# Altium project Yazaki_Led Status.PrjPcb
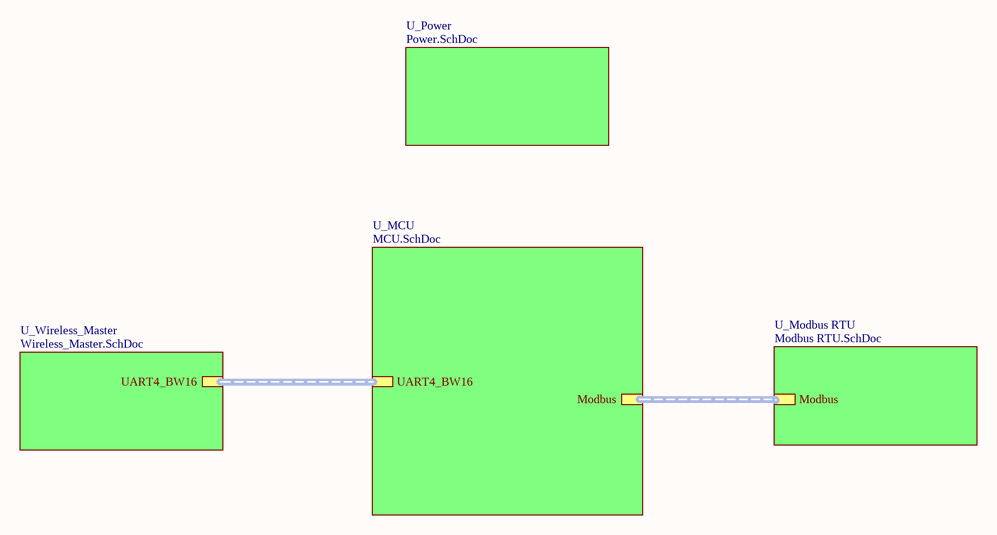
[diagram p0: Yazaki Led.SchDoc]
5 sheets, 81 parts. Net scope: hierarchical (ports join the sheet entries above them; power ports are global).
Board file: PCB.PcbDoc
Sheets:
  Yazaki Led.SchDoc
    U_MCU = MCU.SchDoc
    U_Wireless_Master = Wireless_Master.SchDoc
    U_Power = Power.SchDoc
    U_Modbus RTU = Modbus RTU.SchDoc

## Sheet Yazaki Led.SchDoc
size A4; SheetNumber: 1; SheetTotal: 5

### Sub-sheets
U_MCU = MCU.SchDoc: Modbus (harness Modbus), UART4_BW16 (harness UART4_ESP32)
U_Modbus RTU = Modbus RTU.SchDoc: Modbus (harness Modbus)
U_Power = Power.SchDoc: no entries
U_Wireless_Master = Wireless_Master.SchDoc: UART4_BW16 (harness UART4_ESP32)

### Buses and harness runs
harness sheet U_MCU/Modbus = sheet U_Modbus RTU/Modbus
harness sheet U_MCU/UART4_BW16 = sheet U_Wireless_Master/UART4_BW16

### Notes on the sheet
- Title
- Size:
- Date:
- A3
- Number:
- Time:
- Revision:
- Sheet
- of
- NICHIETSUVN.COM <http://NICHIETSUVN.COM>
- R&D
- File:

## Sheet MCU.SchDoc
size A; SheetNumber: 4; SheetTotal: 5
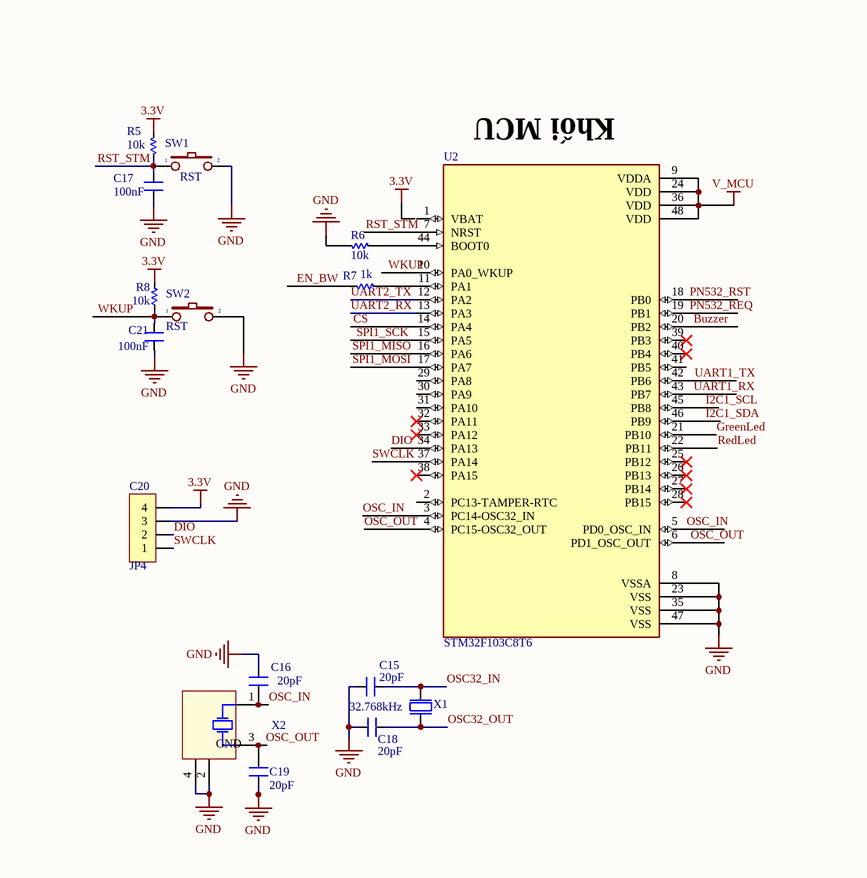
[diagram p1: MCU.SchDoc, left]
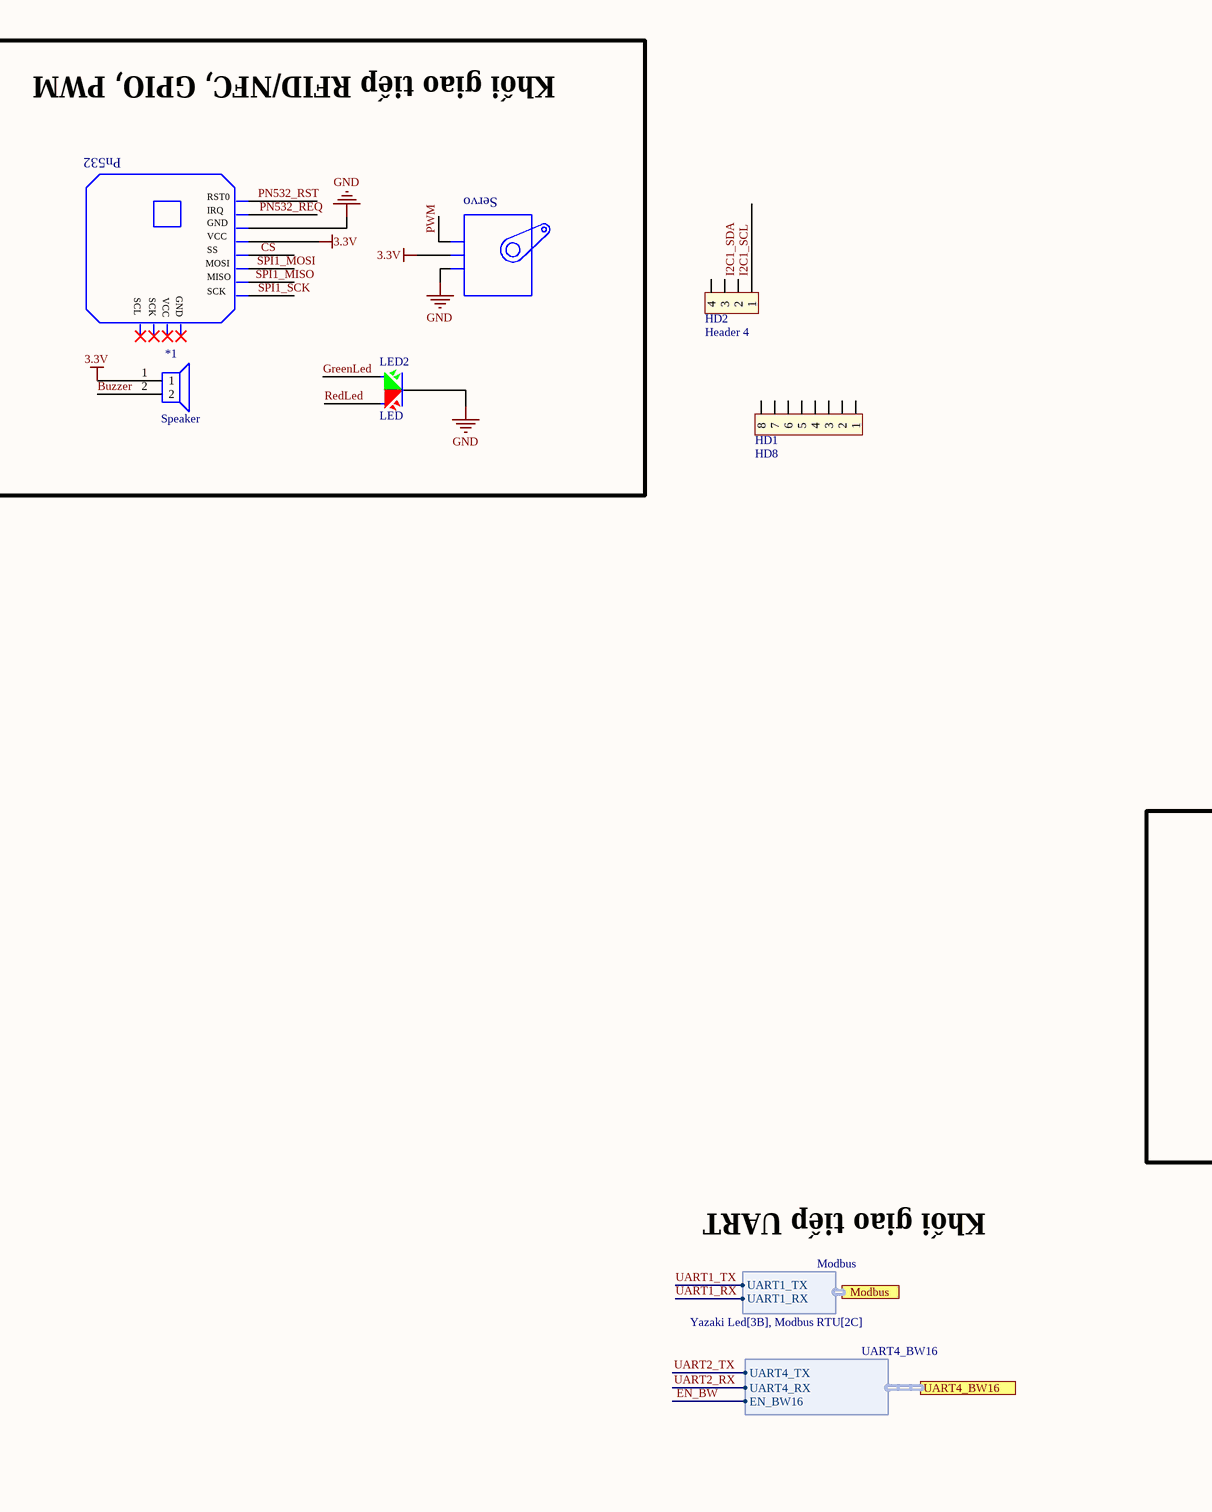
[diagram p2: MCU.SchDoc, right]

### Parts
*1  Speaker  [SPEAKER]
C15  20pF  [CN-SMD-0603]
C16  20pF  [CN-SMD-0603]
C17  100nF  [CN-SMD-0603]
C18  20pF  [CN-SMD-0603]
C19  20pF  [CN-SMD-0603]
C20  JP4  [JP4-C1T]
C21  100nF  [CN-SMD-0603]
HD1  HD8  [Header_8]
HD2  Header 4  [Header_4]
LED2  LED  [LED-52]
R5  10k  [RES-SMD-0603]
R6  10k  [RES-SMD-0603]
R7  1k  [RES-SMD-0603]
R8  10k  [RES-SMD-0603]
SW1  RST  [SW1-SMD]
SW2  RST  [SW1-SMD]
U2  STM32F103C8T6  [QFP50P900X900X160-48N]
X1  32.768kHz  [XTAL_3215]
X2  XT4  [XT4-16.000MHz-4_V]  (value not drawn)

### Ports
Modbus (harness Modbus, see Yazaki Led[3B], Modbus RTU[2C]), UART4_BW16 (harness UART4_BW16, see Yazaki Led[2B], Wireless_Master[2C])

### Harnesses
Modbus: UART1_TX, UART1_RX
UART4_BW16: UART4_TX, UART4_RX, EN_BW16

### Nets
3.3V: *1.1 C20.4 R5.1 R8.1 U2.9(VDDA) U2.24(VDD) U2.36(VDD) U2.48(VDD)  [also labelled V_MCU]
GND: C15.1 C16.2 C17.2 C18.1 C19.1 C20.3 LED2.2 R6.2 SW1.2 SW2.2 U2.8(VSSA) U2.23(VSS) U2.35(VSS) U2.47(VSS) X2.2(GND) X2.4(GND)
Buzzer: *1.2 U2.20(PB2)
CS: U2.14(PA4)
DIO: C20.2 U2.34(PA13)
EN_BW: R7.1 ; port UART4_BW16.EN_BW16
GreenLed: LED2.3 U2.21(PB10)
I2C1_SCL: HD2.1 U2.45(PB8)
I2C1_SDA: U2.46(PB9)
OSC32_IN: C15.2 X1.2(out)
OSC32_OUT: C18.2 X1.1(inp)
OSC_IN: C16.1 U2.3(PC14-OSC32_IN) U2.5(PD0_OSC_IN) X2.1(XTAL)
OSC_OUT: C19.2 U2.4(PC15-OSC32_OUT) U2.6(PD1_OSC_OUT) X2.3(XTAL)
PN532_REQ: U2.19(PB1)
PN532_RST: U2.18(PB0)
RedLed: LED2.1 U2.22(PB11)
RST_STM: C17.1 R5.2 SW1.1 U2.7(NRST)
SPI1_MISO: U2.16(PA6)
SPI1_MOSI: U2.17(PA7)
SPI1_SCK: U2.15(PA5)
SWCLK: C20.1 U2.37(PA14)
UART1_RX: U2.43(PB7) ; port Modbus.UART1_RX
UART1_TX: U2.42(PB6) ; port Modbus.UART1_TX
UART2_RX: U2.13(PA3) ; port UART4_BW16.UART4_RX
UART2_TX: U2.12(PA2) ; port UART4_BW16.UART4_TX
WKUP: R8.2 SW2.1 U2.10(PA0_WKUP)
NetR6_1: R6.1 U2.44(BOOT0)
NetR7_2: R7.2 U2.11(PA1)

Not connected (* = marked no-connect by the designer): C21 1 2; HD1 1 2 3 4 5 6 7 8; HD2 2 3 4; U2 1(VBAT) 2(PC13-TAMPER-RTC) 25(PB12)* 26(PB13)* 27(PB14)* 28(PB15)* 29(PA8) 30(PA9) 31(PA10) 32(PA11)* 33(PA12)* 38(PA15)* 39(PB3)* 40(PB4)* 41(PB5)

### Notes on the sheet
- Khối giao tiếp RFID/NFC, GPIO, PWM
- Pn532
- RST0
- IRQ
- GND
- Servo
- SCL
- SCK
- VCC
- MOSI
- SS
- MISO
- (near U2) Khối MCU
- Khối giao tiếp UART
- Labels drawn without touching a wire or pin: I2C1_SDA

### Library data of the parts
C15-C19 = CN: Value: 33pF
C20 = JP4: WR-PHD 2.54 mm Angled Socket Header; Manufacturer: W¨¹rth Elektronik eiSos GmbH; partNo: 613004143121; ComponentLink1 Description: Manufacturer; ComponentLink2 Description: Datasheet; NoPins: 04; Created Date: 29 March 2013; ComponentLink1URL: http://www.we-online.com; ComponentLink2URL: http://katalog.we-online.de/em/datasheet/6130xx143121.pdf; Created by: Karrer Zheng
C21 = CN_2: Value: 33pF
HD1 = Header8: Header 8; Creat by: VanDungEvn@Gmail.com
HD2 = Header4: Value: Header 4
LED2 = LED2: LED 2 colour Green and Red; Value: LED 3 - 5 ly 2 Colour
R5-R7 = Res-SMD: Resistor; Manufacturer: Generic Components; Class: Passive; Published: 08/06/2000; Publisher: Altium Hobart Technology Centre
R8 = Res-SMD_1: Resistor; Manufacturer: Generic Components; Class: Passive; Published: 08/06/2000; Publisher: Altium Hobart Technology Centre
SW1 SW2 = SW2: Switch button 2 pin; Value: SW chip 2 pin
U2 = STM32F103C8T6: ARMÂ® CortexÂ®-M3 STM32F1 Microcontroller IC 32-Bit 72MHz 64KB (64K x 8) FLASH 48-LQFP (7x7); MF: STMicroelectronics; Package: LQFP-48 STMicroelectronics; Price: None; Check_prices: https://www.snapeda.com/parts/STM32F103C8T6/STMicroelectronics/view-part/?ref=eda; Value: *; SnapEDA_Link: https://www.snapeda.com/parts/STM32F103C8T6/STMicroelectronics/view-part/?ref=snap; MP: STM32F103C8T6; Availability: In Stock; Purchase-URL: https://pricing.snapeda.com/search/part/STM32F103C8T6/?ref=eda
X1 = XTAL_SMD3215: XTAL SMD 3215, 32.768kHz, Cl=9pF, Total Tol: ±50ppm; Part Number: XTAL_SMD3215_32.768kHz_9pF_General; Manufacturer: *; Manufacturer Part Number: *; LatestRevisionDate: 2016-08-19; Pin Count: 2; Publisher: Nordic Semiconductor; Published: 2016-08-19; Value: 32.768kHz; Footprint Doc: XTAL_3215
X2 = XT4: Crystal, 16 MHz, -30 to 85 degC, 3.2 x 2.5 x 0.9 mm SMD; Value: 4Mhz

## Sheet Wireless_Master.SchDoc
size A; SheetNumber: 5; SheetTotal: 5
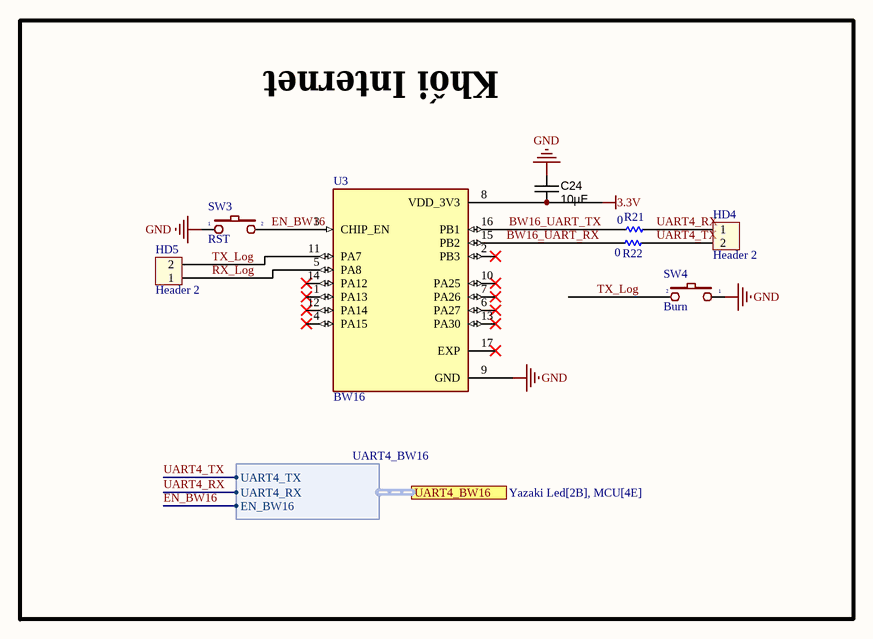
[diagram p3: Wireless_Master.SchDoc]

### Parts
C24  10µF  [CAPC1608X90N]
HD4  Header 2  [Header_2]
HD5  Header 2  [Header_2]
R21  0  [RES-SMD-0603]
R22  0  [RES-SMD-0603]
SW3  RST  [SW1-SMD]
SW4  Burn  [SW1-SMD]
U3  BW16  [MODULE_BW16]

### Ports
UART4_BW16 (harness UART4_BW16, see Yazaki Led[2B], MCU[4E])

### Harnesses
UART4_BW16: UART4_TX, UART4_RX, EN_BW16

### Nets
3.3V: C24.1 U3.8(VDD_3V3)
GND: C24.2 SW3.1 SW4.1 U3.9(GND)
BW16_UART_RX: R22.2 U3.15(PB2)
BW16_UART_TX: R21.2 U3.16(PB1)
EN_BW16: SW3.2 U3.3(CHIP_EN) ; port UART4_BW16.EN_BW16  [project net EN_BW]
RX_Log: HD5.1 U3.5(PA8)
TX_Log: HD5.2 SW4.2 U3.11(PA7)
UART4_RX: HD4.1 R21.1 ; port UART4_BW16.UART4_RX  [project net UART2_RX]
UART4_TX: HD4.2 R22.1 ; port UART4_BW16.UART4_TX  [project net UART2_TX]

Not connected (* = marked no-connect by the designer): U3 1(PA13)* 2(PB3)* 4(PA15)* 6(PA27)* 7(PA26)* 10(PA25)* 12(PA14)* 13(PA30)* 14(PA12)* 17(EXP)*

### Notes on the sheet
- Khối Internet

### Library data of the parts
C24 = CAPC_1uF_0603_X7R_35V_10%: 1µF ±10% 16V Ceramic Capacitor X7R 0603 (1608 Metric); Manufacturer 1: Taiyo Yuden; Manufacturer Part Number 1: GMK107AB7105KAHT; Voltage - Rated: 35V; Pcs 2: 10; Tolerance: ±10%; Operating Temperature: -55°C ~ 125°C; Package / Case: 0603 (1608 Metric); Temperature Coefficient: X7R; Ratings: AEC-Q200; Applications: Automotive; Packaging: Digi-Reel®; Supplier 1: Digi-Key; Supplier Part Number 1: 587-3352-6-ND; Supplier 2: http://www.tme.vn; Supplier Part Number 2: http://www.tme.vn/Product.aspx?id=728#page=pro_info; Price 2: 1800; Value: 10µF
HD4 HD5 = Header2: Value: Header 2
R21 R22 = Res-SMD: as R5 on sheet MCU; Published: 08/06/2000; Publisher: Altium Hobart Technology Centre
SW3 SW4 = SW2: as SW1 on sheet MCU
U3 = BW16: dual-frequency Wi-Fi Bluetooth SoC module; MF: AI-Thinker; Availability: Not in stock; Check_prices: https://www.snapeda.com/parts/BW16/AI-Thinker/view-part/?ref=eda; Value: *; Package: Package; MP: BW16; Price: None; SnapEDA_Link: https://www.snapeda.com/parts/BW16/AI-Thinker/view-part/?ref=snap

## Sheet Power.SchDoc
size A; SheetNumber: 3; SheetTotal: 5
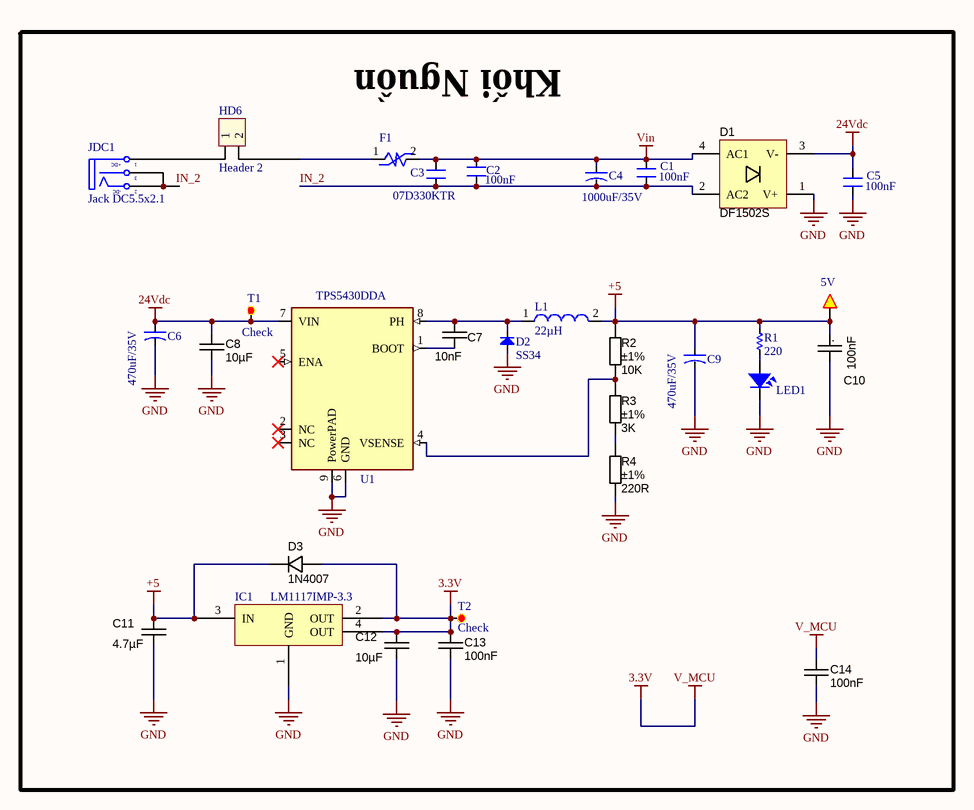
[diagram p4: Power.SchDoc]

### Parts
C1  100nF  [CN-SMD-1206]
C2  100nF  [CN2.5]
C3  07D330KTR  [CN2-T]
C4  1000uF/35V  [CA-ALU-5L]
C5  100nF  [CN-SMD-1206]
C6  470uF/35V  [CA-ALU-6.3]
C7  10nF  [CAPC1608X90N]
C8  10µF  [CAPC2012X135N]
C9  470uF/35V  [CA-ALU-6.3]
C10  100nF  [CAPC2012X135N]
C11  4.7µF  [CAPC2012X135N]
C12  10µF  [CAPC2012X135N]
C13  100nF  [CAPC1608X90N]
C14  100nF  [CAPC1608X90N]
Check1  5V  [SMD-2]
D1  DF1502S  [DIODE_DF_S]
D2  SS34  [DIO-SMD-106]
D3  1N4007  [DO-214AC]
F1  RUEF185  [RUEF165]  (value not drawn)
HD6  Header 2  [Header_2]
IC1  LM1117IMP-3.3  [SOT223]
JDC1  Jack DC5.5x2.1  [DC-IN]
L1  22µH  [IND_COIL_8D43]
LED1  LED  [LED-0805-Blue]  (value not drawn)
R1  220  [RES-SMD-0603]
R2  value 10K  Tolerance: ±1%  [RESC1608X55N]  (hidden comment: 10K_0603_1%)
R3  value 3K  Tolerance: ±1%  [RESC1608X55N]  (hidden comment: 3K_0603_0.5%)
R4  value 220R  Tolerance: ±1%  [RESC1608X55N]  (hidden comment: 220R_0603_1%)
T1  Check  [SMD_1.5]
T2  Check  [SMD_1.5]
U1  TPS5430DDA  [TPS5430]

### Nets
3.3V: C12.2 C13.1 C14.1 D3.A IC1.2(OUT) IC1.4(OUT) T2.1  [also labelled V_MCU]
24Vdc: C5.2 C6.1 C8.2 D1.3(V-) T1.1 U1.7(VIN)
+5: C9.1 C10.1 C11.2 Check1.1 D3.C IC1.3(IN) L1.2 R1.1 R2.2
GND: C5.1 C6.2 C8.1 C9.2 C10.2 C11.1 C12.1 C13.2 C14.2 D1.1(V+) D2.1(A) IC1.1(GND) LED1.2 R4.1 U1.6(GND) U1.9(PowerPAD)
Vin: C1.2 C2.2 C3.2 C4.1 D1.4(AC1) F1.2
IN_2: C1.1 C2.1 C3.1 C4.2 D1.2(AC2) JDC1.2(TN) JDC1.3(S)
NetC7_1: C7.1 U1.1(BOOT)
NetC7_2: C7.2 D2.2(K) L1.1 U1.8(PH)
NetF1_1: F1.1 HD6.2
NetHD6_1: HD6.1 JDC1.1(T)
NetLED1_1: LED1.1 R1.2
NetR2_1: R2.1 R3.2 U1.4(VSENSE)
NetR3_1: R3.1 R4.2

Not connected (* = marked no-connect by the designer): U1 2(NC)* 3(NC)* 5(ENA)*

### Notes on the sheet
- Khối Nguồn
- (in symbol CAPC_100nF_0805_X7R_50V_10%) .
- (in symbol Jac_DC) +DC; -DC

### Library data of the parts
C1-C3 C5 = CN: Value: 33pF
C4 C6 C9 = CN-ALU-DIP: Capacitor (Semiconductor SIM Model); Value: 104; LatestRevisionDate: 17-Jul-2002; LatestRevisionNote: Re-released for DXP Platform.; PackageReference: C1206; Publisher: Altium Limited
C7 = CAPC_10000pF_0603_50V_10%: 10000pF ±10% 50V Ceramic Capacitor X7R 0603 (1608 Metric); Manufacturer 1: TDK Corporation; Manufacturer Part Number 1: CGA3E2X7R1H103K080AA; Pcs 2: 10; Tolerance: ±10%; Operating Temperature: -55°C ~ 125°C; Package / Case: 0603 (1608 Metric); Voltage - Rated: 50V; Ratings: AEC-Q200; Temperature Coefficient: X7R; Supplier Part Number 1: 445-5662-6-ND; Supplier 1: Digi-Key; Supplier 2: https://www.thegioiic.com; Supplier Part Number 2: https://www.thegioiic.com/products/tu-gom-0603-10nf-50v; Price 2: 1900; Value: 10nF
C8 = CAPC_10uF_0805_X7R_25V_10%: 10µF ±10% 25V Ceramic Capacitor X7R 1206 (3216 Metric); Manufacturer 1: Taiyo Yuden; Manufacturer Part Number: TMK316AB7106KLHT; Pcs 2: 10; Supplier 1: Digi-Key; Supplier Part Number 1: 587-3485-6-ND; Tolerance: ±10%; Operating Temperature: -55°C ~ 125°C; Package / Case: 0805 (2012 metric); Voltage - Rated: 25V; Ratings: AEC-Q200; Temperature Coefficient: X7R; Supplier 2: https://www.thegioiic.com; Supplier Part Number 2: https://www.thegioiic.com/products/tu-gom-0805-10uf-25v; Price 2: 5800; Value: 10µF
C10 = CAPC_100nF_0805_X7R_50V_10%: 0.1µF ±10% 50V Ceramic Capacitor X7R 0805 (2012 Metric); Manufacturer 1: Samsung Electro-Mechanics; Manufacturer Part Number: CL21B104KBFXPJE; Pcs 2: 10; Supplier 1: Digi-Key; Supplier Part Number 1: 1276-CL21B104KBFXPJEDKR-ND; Tolerance: ±10%; Operating Temperature: -55°C ~ 125°C; Package / Case: 0805 (2012 metric); Voltage - Rated: 50V; Ratings: AEC-Q200; Temperature Coefficient: X7R; Price 2: 2000; Supplier 2: https://www.thegioiic.com; Supplier Part Number 2: https://www.thegioiic.com/products/tu-gom-0805-100nf-0-1uf-50v; Value: 100nF
C11 C12 = CAPC_4.7uF_0805_X7R_50V_10%: 4.7µF ±10% 50V Ceramic Capacitor X7R 0805 (2012 Metric); Manufacturer 1: TDK Corporation; Manufacturer Part Number: CGA4J1X7R1H475K125AE; Pcs 2: 1; Package / Case: 0805 (2012 metric); Tolerance: ±10%; Voltage - Rated: 50V; Temperature Coefficient: X7R; Ratings: AEC-Q200; Operating Temperature: -55°C ~ 125°C; Supplier 1: Digi-Key; Supplier Part Number 1: 445-181410-6-ND; Supplier 2: https://www.thegioiic.com; Supplier Part Number 2: https://www.thegioiic.com/products/tu-gom-0805-4-7uf-50v; Price 2: 680
  C11: Value: 4.7µF
  C12: Value: 10µF
C13 C14 = CAPC_100nF_0603_X7R_50V_10%: 0.1µF ±10% 50V Ceramic Capacitor X7R 0603 (1608 Metric); Manufacturer 1: TDK Corporation; Manufacturer Part Number 1: CGA3E2X7R1H104K080AA; Pcs 2: 10; Supplier 1: Digi-Key; Supplier Part Number 1: 445-5666-6-ND; Tolerance: ±10%; Operating Temperature: -55°C ~ 125°C; Package / Case: 0603 (1608 Metric); Voltage - Rated: 50V; Ratings: AEC-Q200; Temperature Coefficient: X7R; Applications: Automotive; Packaging: Digi-Reel®; Supplier 2: www.thegioiic.com; Supplier Part Number 2: https://www.thegioiic.com/products/tu-gom-0603-100nf-0-1uf-50v; Price 2: 1800; Value: 100nF
Check1 T1 T2 = Test: WR-PHD 2.54 mm Angled Socket Header; Manufacturer: W¨¹rth Elektronik eiSos GmbH; partNo: 613002143121; ComponentLink1 Description: Manufacturer; ComponentLink2 Description: Datasheet; NoPins: 02; Created Date: 29 March 2013; ComponentLink1URL: http://www.we-online.com; ComponentLink2URL: http://katalog.we-online.de/em/datasheet/6130xx143121.pdf; Created by: Karrer Zheng
D1 = DIODE_DF1502S: Bridge Rectifier Single Phase Standard 200V Surface Mount DF-S; Manufacturer 1: Diodes Incorporated; Manufacturer Part Number 1: DF1502S-T; Ratings: 200V; 1.5A; Pcs 2: 1; Package / Case: 4-SMD, Gull Wing; Diode Type: Standard; Mounting Type: Surface Mount; Supplier 1: Digi-Key; Supplier Part Number 1: DF1502SDIDKR-ND; Supplier 2: https://www.thegioiic.com; Supplier Part Number 2: https://www.thegioiic.com/products/df1502s-cau-chinh-luu-200v-1-5a; Price 2: 3500
D2 = Diode SMD: Default Diode; Code - JEDEC: DO-214-AB; Value: 1N5007; Published: 8-Jun-2000; Revision: July-2002: Re-released for DXP Platform.; Publisher: Altium Limited
D3 = DIODE_1N4007: Diode  Standard Rectifier SMD 1000V 1A SMA; Manufacturer 1: Micro Commercial Co; Manufacturer Part Number 1: SM4007PL-TP; Speed: Standard Recovery >500ns, > 200mA (Io); Ratings: 1000V; 1A; Pcs 2: 1; Package / Case: DO-214AC, SMA; Diode Type: Standard; Mounting Type: Surface Mount; Supplier 1: Digi-Key; Supplier Part Number 1: SM4007PL-TPMSDKR-ND; Supplier 2: https://www.thegioiic.com; Supplier Part Number 2: https://www.thegioiic.com/products/1n4007-m7-diode-chinh-luu-1a-1kv; Price 2: 1000
HD6 = Header2: Value: Header 2
IC1 = IC_LM1117IMP-3.3: Linear Voltage Regulator IC  1 Output  800mA SOT-223; Manufacturer: Texas Instruments; Manufacturer Part Number: LM1117IMP-3.3/NOPB; Voltage - Input (Max): 15V; Voltage Dropout (Max): 1.2V @ 800mA; Protection Features: Over Current, Over Temperature; PSRR: 75dB (120Hz); Pcs 2: 1; Supplier 1: Digi-Key; Supplier Part Number 1: LM1117IMP-3.3/NOPBDKR-ND; Current - Output: 800mA; Operating Temperature: -40°C ~ 125°C; Price 2: 11000; Supplier Device Package: SOT-223; Supplier 2: https://www.thegioiic.com; Supplier Part Number 2: https://www.thegioiic.com/products/lm1117imp-3-3-nopb-ic-on-ap-3-3v-800ma
JDC1 = Jac_DC: Cắm; Ten_Linh_Kien: Jack DC5.5x2.1MM DC5501; Ma_Hang: MH000923; Don_Vi: Con; Kieu_Chan: *; Ghi_Chu: *; Chung_Loai: Cắm
L1 = INDC_SMD_22uH_8D43: 22µH Shielded Wirewound Inductor 950mA 380mOhm Max Nonstandard; Manufacturer 1: Yageo; Current Rating (Amps): 3.25 A; Ratings: None AEC-Q200; Pcs 2: 1; Supplier 1: Digi-Key; Operating Temperature: -40°C ~ 125°C; Value: 22µH; Supplier 2: https://www.thegioiic.com/; Supplier Part Number 2: https://www.thegioiic.com/products/cuon-cam-dan-smd-8d43-220-22uh-3-25a; Price 2: 2000
LED1 = LED SMD: Value: LED 3 - 5 ly 2 Colour
R1 = Res-SMD: as R5 on sheet MCU; Published: 08/06/2000; Publisher: Altium Hobart Technology Centre
R2 = RES_10K_0603_1%: 10 kOhms ±1% 0.1W, 1/10W Chip Resistor 0603 (1608 Metric) Anti-Sulfur, Automotive AEC-Q200, Moisture Resistant Thin Film; Manufacturer: Stackpole Electronics Inc; Manufacturer Part Number: RMCF0603FT10K0; Temperature Coefficient: ±100ppm/°C; Pcs 2: 50; Package / Case: 0603 (1608 Metric); Power (Watts): 1/10W; Supplier 1: Digi-Key; Supplier Part Number 1: RMCF0603FT10K0DKR-ND; Ratings: Automotive AEC-Q200; Operating Temperature: -55°C ~ 155°C; Supplier 2: www.thegioiic.com; Supplier Part Number 2: https://www.thegioiic.com/products/dien-tro-10-kohm-0603-1; Price 2: 2000
R3 = RES_3K_0603_1%: 3 kOhms ±1% 0.1W, 1/10W Chip Resistor 0603 (1608 Metric) Automotive AEC-Q200 Thick Film; Manufacturer: Stackpole Electronics Inc; Manufacturer Part Number: RMCF0603FT3K00; Temperature Coefficient: ±100ppm/°C; Pcs 2: 50; Package / Case: 0603 (1608 Metric); Power (Watts): 1/10W; Supplier 1: Digi-Key; Supplier Part Number 1: RMCF0603FT3K00DKR-ND; Ratings: AEC-Q200; Supplier Part Number 2: https://www.thegioiic.com/products/dien-tro-3-kohm-0603-1; Supplier 2: www.thegioiic.com; Operating Temperature: -55°C ~ 155°C; Price 2: 2000
R4 = RES_220R_0603_1%: 220 Ohms ±1% 0.1W, 1/10W Chip Resistor 0603 (1608 Metric) Automotive AEC-Q200 Thick Film; Manufacturer: Stackpole Electronics Inc; Manufacturer Part Number: RMCF0603FT220R; Temperature Coefficient: ±100ppm/°C; Pcs 2: 50; Package / Case: 0603 (1608 Metric); Ratings: AEC-Q200; Supplier 1: Digi-Key; Supplier Part Number 1: RMCF0603FT220RDKR-ND; Power (Watts): 0.1W, 1/10W; Operating Temperature: -55°C ~ 155°C; Composition: Thick Film; Supplier 2: www.thegioiic.com; Supplier Part Number 2: https://www.thegioiic.com/products/dien-tro-220-ohm-0603-1; Price 2: 2000

## Sheet Modbus RTU.SchDoc
size A; SheetNumber: 2; SheetTotal: 5
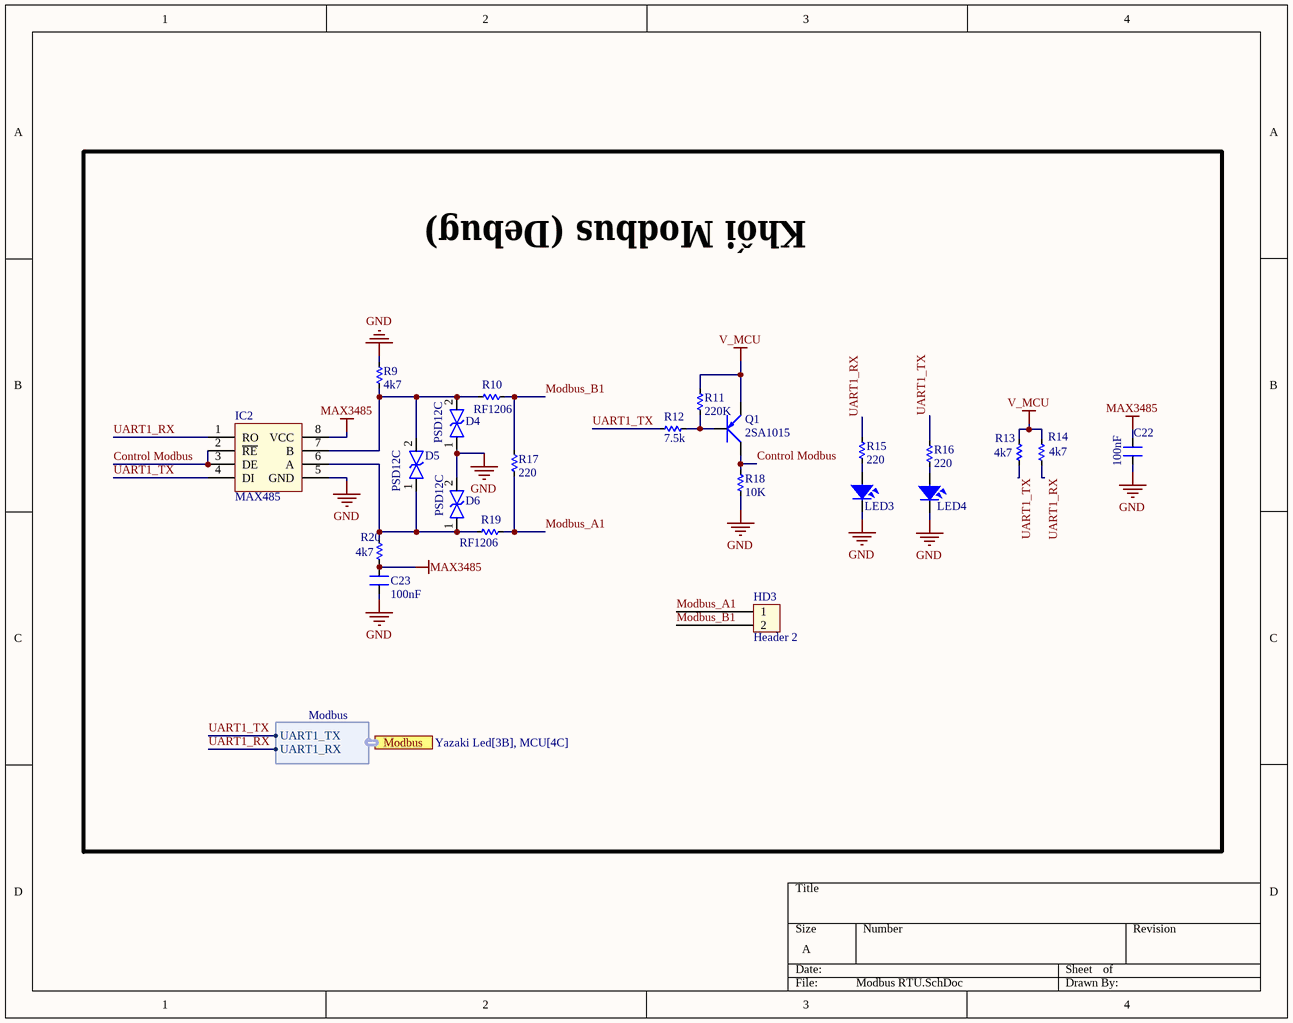
[diagram p5: Modbus RTU.SchDoc]

### Parts
C22  100nF  [CN-SMD-0603]
C23  100nF  [CN-SMD-0603]
D4  PSD12C  [PSD12C]
D5  PSD12C  [PSD12C]
D6  PSD12C  [PSD12C]
HD3  Header 2  [Header_2]
IC2  MAX485  [SO8]
LED3  LED  [LED-0805-Blue]  (value not drawn)
LED4  LED  [LED-0805-Blue]  (value not drawn)
Q1  2SA1015  [SOT23-321]
R9  4k7  [RES-SMD-0603]
R10  RF1206  [RES-SMD-1206]
R11  220K  [RES-SMD-0603]
R12  7.5k  [RES-SMD-0603]
R13  4k7  [RES-SMD-0603]
R14  4k7  [RES-SMD-0603]
R15  220  [RES-SMD-0603]
R16  220  [RES-SMD-0603]
R17  220  [RES-SMD-0603]
R18  10K  [RES-SMD-0603]
R19  RF1206  [RES-SMD-1206]
R20  4k7  [RES-SMD-0603]

### Ports
Modbus (harness Modbus, see Yazaki Led[3B], MCU[4C])

### Harnesses
Modbus: UART1_TX, UART1_RX

### Nets
GND: C22.1 C23.2 D4.1 D6.2 IC2.5(GND) LED3.2 LED4.2 R9.1 R18.1
MAX3485: C22.2 C23.1 IC2.8(VCC) R20.1
V_MCU: Q1.1(E) R11.2 R13.1 R14.1  [project net 3.3V]
Control Modbus: IC2.2(~{RE}) IC2.3(DE) Q1.2(C) R18.2
Modbus_A1: HD3.1 R17.2 R19.1
Modbus_B1: HD3.2 R10.1 R17.1
UART1_RX: IC2.1(RO) R14.2 R15.1 ; port Modbus.UART1_RX
UART1_TX: IC2.4(DI) R12.1 R13.2 R16.1 ; port Modbus.UART1_TX
NetD4_2: D4.2 D5.2 IC2.7(B) R9.2 R10.2
NetD5_1: D5.1 D6.1 IC2.6(A) R19.2 R20.2
NetLED3_1: LED3.1 R15.2
NetLED4_1: LED4.1 R16.2
NetQ1_3: Q1.3(B) R11.1 R12.2

### Notes on the sheet
- Khối Modbus (Debug)

### Library data of the parts
C22 C23 = CN: Value: 33pF
D4-D6 = PSD12C: diode tvs
HD3 = Header2: Value: Header 2
IC2 = MAX485: RS232 - RS485 (Same sn75176)
LED3 LED4 = LED SMD: Value: LED 3 - 5 ly 2 Colour
Q1 = 2SA1015: PNP 600mW, ECB; Value: A1015
R9-R20 = Res-SMD: as R5 on sheet MCU; Published: 08/06/2000; Publisher: Altium Hobart Technology Centre

## Nets that join several sheets
3.3V: MCU (8 pins), Wireless_Master (C24.1 U3.8), Power (7 pins), Modbus RTU (Q1.1 R11.2 R13.1 R14.1)
GND: MCU (16 pins), Wireless_Master (C24.2 SW3.1 SW4.1 U3.9), Power (16 pins), Modbus RTU (9 pins)
EN_BW: MCU (R7.1), Wireless_Master (SW3.2 U3.3)
UART1_RX: MCU (U2.43), Modbus RTU (IC2.1 R14.2 R15.1)
UART1_TX: MCU (U2.42), Modbus RTU (IC2.4 R12.1 R13.2 R16.1)
UART2_RX: MCU (U2.13), Wireless_Master (HD4.1 R21.1)
UART2_TX: MCU (U2.12), Wireless_Master (HD4.2 R22.1)